# Altium schematic sheet Highdriver.SchDoc
size A4; SheetNumber: 4; SheetTotal: 4
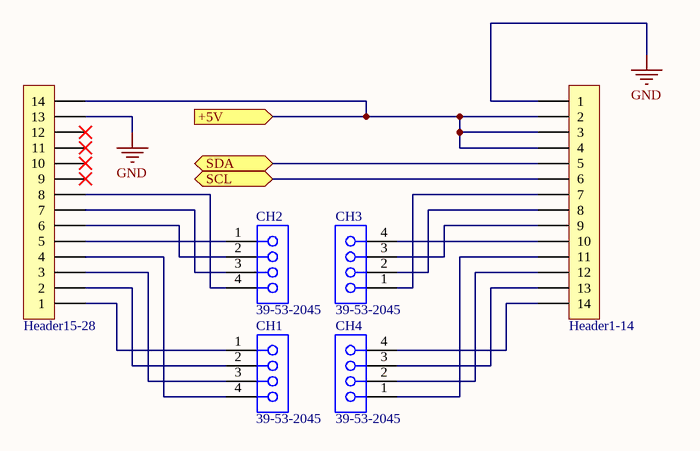
[diagram p0: Highdriver.SchDoc]

## Parts
CH1  39-53-2045  [MOLX-39-53-2045]
CH2  39-53-2045  [MOLX-39-53-2045]
CH3  39-53-2045  [MOLX-39-53-2045]
CH4  39-53-2045  [MOLX-39-53-2045]
Header1-14  PH1x14  [PH2,54mm-1x14]  (value not drawn)
Header15-28  PH1x14  [PH2,54mm-1x14]  (value not drawn)

## Ports
+5V (in), SCL (bidir), SDA (bidir)

## Nets
GND: Header1-14.1 Header15-28.13
+5V: Header1-14.2 Header1-14.3 Header1-14.4 Header15-28.14 ; port +5V
SCL: Header1-14.6 ; port SCL
SDA: Header1-14.5 ; port SDA
NetCH1_1: CH1.1 Header15-28.1
NetCH1_2: CH1.2 Header15-28.2
NetCH1_3: CH1.3 Header15-28.3
NetCH1_4: CH1.4 Header15-28.4
NetCH2_1: CH2.1 Header15-28.5
NetCH2_2: CH2.2 Header15-28.6
NetCH2_3: CH2.3 Header15-28.7
NetCH2_4: CH2.4 Header15-28.8
NetCH3_1: CH3.1 Header1-14.7
NetCH3_2: CH3.2 Header1-14.8
NetCH3_3: CH3.3 Header1-14.9
NetCH3_4: CH3.4 Header1-14.10
NetCH4_1: CH4.1 Header1-14.11
NetCH4_2: CH4.2 Header1-14.12
NetCH4_3: CH4.3 Header1-14.13
NetCH4_4: CH4.4 Header1-14.14

Not connected (* = marked no-connect by the designer): Header15-28 9* 10* 11* 12*

## Library data of the parts
CH1-CH4 = CMP-1242-00004-1: 1.25 mm Pitch FPC Connector, 7.5 mm Mated Height, Vertical, ZIF, Through Hole, 4 Circuits, -20 to 80 degC, ELV and RoHS Compliant, Tray; Manufacturer: Molex; Material - Metal: Phosphor Bronze; Circuits (Loaded): 4; Polarized to PCB: No; PCB Retention: None; Pitch - Mating Interface: 1.25mm; Durability (mating cycles max): 30; Mated Height: 7.50mm; Current (Max per Contact): 1A; Voltage (Max): 200V; Material - Plating Termination: Tin-Bismuth; PackageVersion: Rev. A, 12/2004; PackageDescription: 4-Lead FPC Connector, Pitch 1.25 mm; PackageReference: 39-53-2045; PartNumber: 39-53-2045; ComponentLink3URL: http://www.molex.com/pdm_docs/sd/039532045_sd.pdf; ComponentLink3Description: Package Specification; ComponentLink1Description: Manufacturer URL; Contact Position: N/A; Entry Angle: Vertical; ComponentLink1URL: http://www.molex.com/molex/index.jsp; Stackable: No; RoHS: TRUE; ComponentLink2URL: http://www.molex.com/webdocs/datasheets/pdf/en-us/0039532045_FFC_FPC_CONNECTORS.pdf; Packing: Tray; Mounting Technology: Through Hole; PCB Locator: No; Orientation: Vertical; ComponentLink2Description: Datasheet; Number of Rows: 1; Material - Plating Mating: Tin-Bismuth
Header1-14 Header15-28 = PH2,54mm-1x14: Part Number: PH2,54mm-1x14